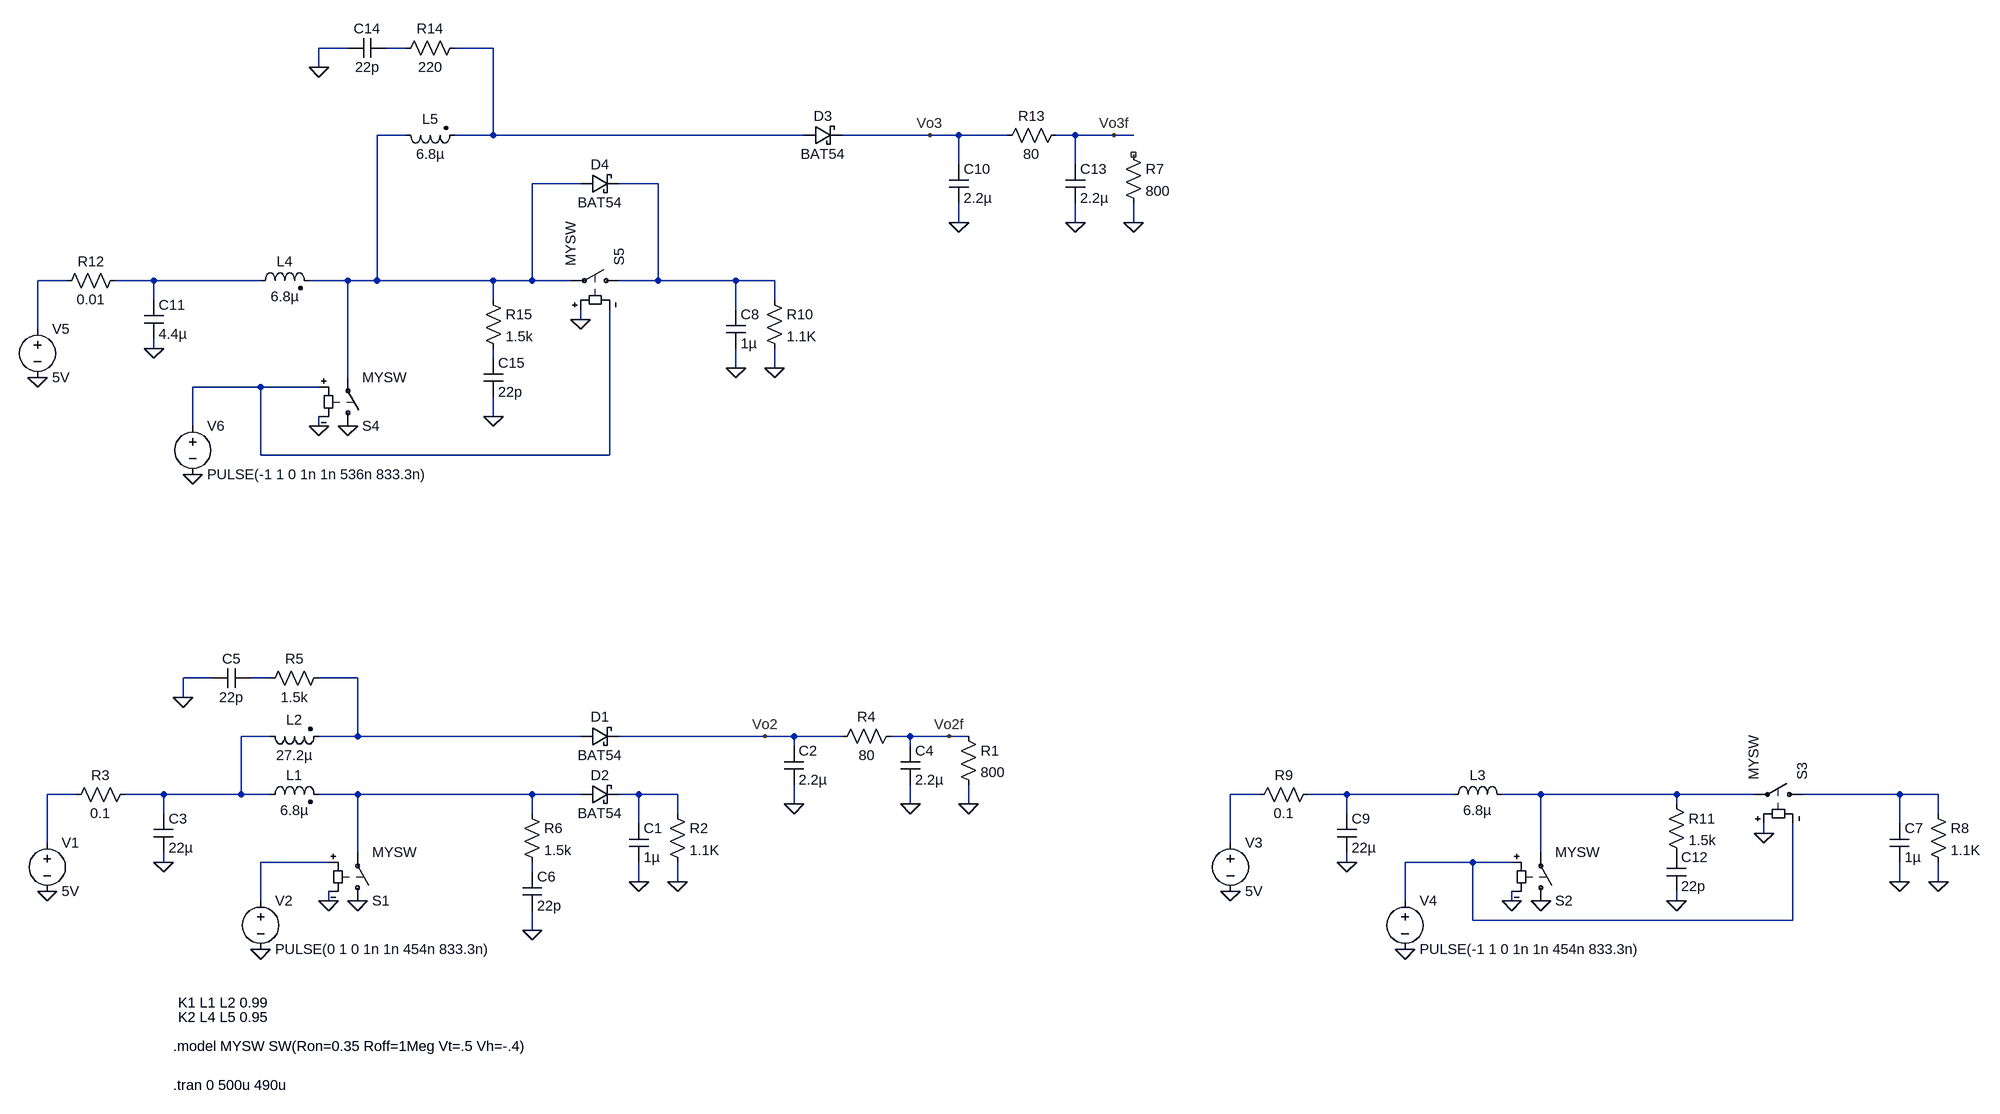
[diagram p0: schematic boost.asc]
boost.asc, the LTspice schematic file:
Version 4
SHEET 1 3604 680
WIRE 272 -1200 224 -1200
WIRE 368 -1200 336 -1200
WIRE 512 -1200 448 -1200
WIRE 224 -1168 224 -1200
WIRE 368 -1056 320 -1056
WIRE 512 -1056 512 -1200
WIRE 512 -1056 448 -1056
WIRE 1024 -1056 512 -1056
WIRE 1232 -1056 1088 -1056
WIRE 1280 -1056 1232 -1056
WIRE 1360 -1056 1280 -1056
WIRE 1472 -1056 1440 -1056
WIRE 1536 -1056 1472 -1056
WIRE 1568 -1056 1536 -1056
WIRE 1280 -1008 1280 -1056
WIRE 1472 -1008 1472 -1056
WIRE 656 -976 576 -976
WIRE 784 -976 720 -976
WIRE 1280 -912 1280 -944
WIRE 1472 -912 1472 -944
WIRE 1568 -912 1568 -944
WIRE -192 -816 -240 -816
WIRE -48 -816 -112 -816
WIRE 128 -816 -48 -816
WIRE 272 -816 208 -816
WIRE 320 -816 320 -1056
WIRE 320 -816 272 -816
WIRE 512 -816 320 -816
WIRE 576 -816 576 -976
WIRE 576 -816 512 -816
WIRE 640 -816 576 -816
WIRE 784 -816 784 -976
WIRE 784 -816 720 -816
WIRE 912 -816 784 -816
WIRE 976 -816 912 -816
WIRE -48 -784 -48 -816
WIRE 512 -784 512 -816
WIRE 976 -784 976 -816
WIRE 912 -768 912 -816
WIRE 656 -752 656 -768
WIRE -240 -736 -240 -816
WIRE -48 -704 -48 -720
WIRE 512 -688 512 -704
WIRE 912 -672 912 -704
WIRE 976 -672 976 -704
WIRE 272 -656 272 -816
WIRE 128 -640 16 -640
WIRE 224 -640 128 -640
WIRE 512 -592 512 -624
WIRE 16 -576 16 -640
WIRE 224 -576 224 -592
WIRE 128 -528 128 -640
WIRE 704 -528 704 -768
WIRE 704 -528 128 -528
WIRE 48 -160 0 -160
WIRE 144 -160 112 -160
WIRE 288 -160 224 -160
WIRE 0 -128 0 -160
WIRE 144 -64 96 -64
WIRE 288 -64 288 -160
WIRE 288 -64 224 -64
WIRE 656 -64 288 -64
WIRE 960 -64 720 -64
WIRE 1008 -64 960 -64
WIRE 1088 -64 1008 -64
WIRE 1200 -64 1168 -64
WIRE 1264 -64 1200 -64
WIRE 1296 -64 1264 -64
WIRE 1008 -48 1008 -64
WIRE 1200 -48 1200 -64
WIRE -176 32 -224 32
WIRE -32 32 -96 32
WIRE 96 32 96 -64
WIRE 96 32 -32 32
WIRE 144 32 96 32
WIRE 288 32 224 32
WIRE 576 32 288 32
WIRE 656 32 576 32
WIRE 752 32 720 32
WIRE 816 32 752 32
WIRE 1776 32 1728 32
WIRE 1920 32 1856 32
WIRE 2096 32 1920 32
WIRE 2240 32 2176 32
WIRE 2464 32 2240 32
WIRE 2592 32 2464 32
WIRE 2832 32 2672 32
WIRE 2896 32 2832 32
WIRE 1008 48 1008 16
WIRE 1200 48 1200 16
WIRE 1296 48 1296 16
WIRE 2464 48 2464 32
WIRE -32 64 -32 32
WIRE 576 64 576 32
WIRE 816 64 816 32
WIRE 1920 64 1920 32
WIRE 2896 64 2896 32
WIRE 752 80 752 32
WIRE 2832 80 2832 32
WIRE 2608 96 2608 80
WIRE -224 112 -224 32
WIRE 1728 112 1728 32
WIRE 288 128 288 32
WIRE 2240 128 2240 32
WIRE -32 144 -32 128
WIRE 240 144 128 144
WIRE 1920 144 1920 128
WIRE 2128 144 2016 144
WIRE 2192 144 2128 144
WIRE 576 160 576 144
WIRE 752 176 752 144
WIRE 816 176 816 144
WIRE 2832 176 2832 144
WIRE 2896 176 2896 144
WIRE 128 208 128 144
WIRE 240 208 240 192
WIRE 2016 208 2016 144
WIRE 2192 208 2192 192
WIRE 2464 208 2464 192
WIRE 2128 240 2128 144
WIRE 2656 240 2656 80
WIRE 2656 240 2128 240
WIRE 576 256 576 224
FLAG -224 192 0
FLAG 752 176 0
FLAG 1008 48 0
FLAG 816 176 0
FLAG 1296 48 0
FLAG 288 208 0
FLAG 240 208 0
FLAG 128 288 0
FLAG -32 144 0
FLAG 1200 48 0
FLAG 960 -64 Vo2
FLAG 1264 -64 Vo2f
FLAG 0 -128 0
FLAG 576 256 0
FLAG 1728 192 0
FLAG 2832 176 0
FLAG 2896 176 0
FLAG 2240 208 0
FLAG 2192 208 0
FLAG 2016 288 0
FLAG 1920 144 0
FLAG 2608 96 0
FLAG 2464 208 0
FLAG -240 -656 0
FLAG 912 -672 0
FLAG 1280 -912 0
FLAG 976 -672 0
FLAG 1568 -912 0
FLAG 272 -576 0
FLAG 224 -576 0
FLAG 16 -496 0
FLAG -48 -704 0
FLAG 1472 -912 0
FLAG 1232 -1056 Vo3
FLAG 1536 -1056 Vo3f
FLAG 224 -1168 0
FLAG 512 -592 0
FLAG 656 -752 0
SYMBOL voltage -224 96 R0
WINDOW 123 0 0 Left 0
WINDOW 39 0 0 Left 0
SYMATTR InstName V1
SYMATTR Value 5V
SYMBOL ind2 128 48 R270
WINDOW 0 32 56 VTop 2
WINDOW 3 5 56 VBottom 2
SYMATTR InstName L1
SYMATTR Value 6.8µ
SYMATTR Type ind
SYMBOL ind2 128 -80 M90
WINDOW 0 5 56 VBottom 2
WINDOW 3 32 56 VTop 2
SYMATTR InstName L2
SYMATTR Value 27.2µ
SYMATTR Type ind
SYMBOL schottky 656 -48 R270
WINDOW 0 32 32 VTop 2
WINDOW 3 0 32 VBottom 2
SYMATTR InstName D1
SYMATTR Value BAT54
SYMATTR Description Diode
SYMATTR Type diode
SYMBOL schottky 656 48 R270
WINDOW 0 32 32 VTop 2
WINDOW 3 0 32 VBottom 2
SYMATTR InstName D2
SYMATTR Value BAT54
SYMATTR Description Diode
SYMATTR Type diode
SYMBOL cap 736 80 R0
SYMATTR InstName C1
SYMATTR Value 1µ
SYMBOL cap 992 -48 R0
SYMATTR InstName C2
SYMATTR Value 2.2µ
SYMBOL res 1280 -80 R0
SYMATTR InstName R1
SYMATTR Value 800
SYMBOL res 800 48 R0
SYMATTR InstName R2
SYMATTR Value 1.1K
SYMBOL sw 288 224 M180
SYMATTR InstName S1
SYMATTR Value MYSW
SYMBOL voltage 128 192 R0
WINDOW 123 0 0 Left 0
WINDOW 39 0 0 Left 0
SYMATTR InstName V2
SYMATTR Value PULSE(0 1 0 1n 1n 454n 833.3n)
SYMBOL res -192 48 R270
WINDOW 0 32 56 VTop 2
WINDOW 3 0 56 VBottom 2
SYMATTR InstName R3
SYMATTR Value 0.1
SYMBOL cap -48 64 R0
SYMATTR InstName C3
SYMATTR Value 22µ
SYMBOL res 1184 -80 R90
WINDOW 0 0 56 VBottom 2
WINDOW 3 32 56 VTop 2
SYMATTR InstName R4
SYMATTR Value 80
SYMBOL cap 1184 -48 R0
SYMATTR InstName C4
SYMATTR Value 2.2µ
SYMBOL res 240 -176 R90
WINDOW 0 0 56 VBottom 2
WINDOW 3 32 56 VTop 2
SYMATTR InstName R5
SYMATTR Value 1.5k
SYMBOL cap 112 -176 R90
WINDOW 0 0 32 VBottom 2
WINDOW 3 32 32 VTop 2
SYMATTR InstName C5
SYMATTR Value 22p
SYMBOL res 560 48 R0
SYMATTR InstName R6
SYMATTR Value 1.5k
SYMBOL cap 560 160 R0
SYMATTR InstName C6
SYMATTR Value 22p
SYMBOL voltage 1728 96 R0
WINDOW 123 0 0 Left 0
WINDOW 39 0 0 Left 0
SYMATTR InstName V3
SYMATTR Value 5V
SYMBOL cap 2816 80 R0
SYMATTR InstName C7
SYMATTR Value 1µ
SYMBOL res 2880 48 R0
SYMATTR InstName R8
SYMATTR Value 1.1K
SYMBOL sw 2240 224 M180
SYMATTR InstName S2
SYMATTR Value MYSW
SYMBOL voltage 2016 192 R0
WINDOW 123 0 0 Left 0
WINDOW 39 0 0 Left 0
SYMATTR InstName V4
SYMATTR Value PULSE(-1 1 0 1n 1n 454n 833.3n)
SYMBOL res 1760 48 R270
WINDOW 0 32 56 VTop 2
WINDOW 3 0 56 VBottom 2
SYMATTR InstName R9
SYMATTR Value 0.1
SYMBOL cap 1904 64 R0
SYMATTR InstName C9
SYMATTR Value 22µ
SYMBOL ind 2080 48 R270
WINDOW 0 32 56 VTop 2
WINDOW 3 5 56 VBottom 2
SYMATTR InstName L3
SYMATTR Value 6.8µ
SYMBOL sw 2688 32 M270
SYMATTR InstName S3
SYMATTR Value MYSW
SYMBOL res 2448 32 R0
SYMATTR InstName R11
SYMATTR Value 1.5k
SYMBOL cap 2448 128 R0
SYMATTR InstName C12
SYMATTR Value 22p
SYMBOL voltage -240 -752 R0
WINDOW 123 0 0 Left 0
WINDOW 39 0 0 Left 0
SYMATTR InstName V5
SYMATTR Value 5V
SYMBOL ind2 112 -800 R270
WINDOW 0 32 56 VTop 2
WINDOW 3 5 56 VBottom 2
SYMATTR InstName L4
SYMATTR Value 6.8µ
SYMATTR Type ind
SYMBOL ind2 352 -1072 M90
WINDOW 0 5 56 VBottom 2
WINDOW 3 32 56 VTop 2
SYMATTR InstName L5
SYMATTR Value 6.8µ
SYMATTR Type ind
SYMBOL schottky 1024 -1040 R270
WINDOW 0 32 32 VTop 2
WINDOW 3 0 32 VBottom 2
SYMATTR InstName D3
SYMATTR Value BAT54
SYMATTR Description Diode
SYMATTR Type diode
SYMBOL cap 896 -768 R0
SYMATTR InstName C8
SYMATTR Value 1µ
SYMBOL cap 1264 -1008 R0
SYMATTR InstName C10
SYMATTR Value 2.2µ
SYMBOL res 1552 -1040 R0
SYMATTR InstName R7
SYMATTR Value 800
SYMBOL res 960 -800 R0
SYMATTR InstName R10
SYMATTR Value 1.1K
SYMBOL sw 272 -560 M180
SYMATTR InstName S4
SYMATTR Value MYSW
SYMBOL voltage 16 -592 R0
WINDOW 123 0 0 Left 0
WINDOW 39 0 0 Left 0
SYMATTR InstName V6
SYMATTR Value PULSE(-1 1 0 1n 1n 536n 833.3n)
SYMBOL res -208 -800 R270
WINDOW 0 32 56 VTop 2
WINDOW 3 0 56 VBottom 2
SYMATTR InstName R12
SYMATTR Value 0.01
SYMBOL cap -64 -784 R0
SYMATTR InstName C11
SYMATTR Value 4.4µ
SYMBOL res 1456 -1072 R90
WINDOW 0 0 56 VBottom 2
WINDOW 3 32 56 VTop 2
SYMATTR InstName R13
SYMATTR Value 80
SYMBOL cap 1456 -1008 R0
SYMATTR InstName C13
SYMATTR Value 2.2µ
SYMBOL res 464 -1216 R90
WINDOW 0 0 56 VBottom 2
WINDOW 3 32 56 VTop 2
SYMATTR InstName R14
SYMATTR Value 220
SYMBOL cap 336 -1216 R90
WINDOW 0 0 32 VBottom 2
WINDOW 3 32 32 VTop 2
SYMATTR InstName C14
SYMATTR Value 22p
SYMBOL res 496 -800 R0
SYMATTR InstName R15
SYMATTR Value 1.5k
SYMBOL cap 496 -688 R0
SYMATTR InstName C15
SYMATTR Value 22p
SYMBOL sw 736 -816 M270
SYMATTR InstName S5
SYMATTR Value MYSW
SYMBOL schottky 656 -960 R270
WINDOW 0 32 32 VTop 2
WINDOW 3 0 32 VBottom 2
SYMATTR InstName D4
SYMATTR Value BAT54
SYMATTR Description Diode
SYMATTR Type diode
TEXT -16 448 Left 2 !.model MYSW SW(Ron=0.35 Roff=1Meg Vt=.5 Vh=-.4)
TEXT -16 512 Left 2 !.tran 0 500u 490u
TEXT -8 376 Left 2 !K1 L1 L2 0.99
TEXT -8 400 Left 2 !K2 L4 L5 0.95

The netlist it stands for:
* boost.asc
V1 N012 0 5V
L1 N011 N013 6.8µ
L2 N011 N010 27.2µ
D1 N010 Vo2 BAT54
D2 N013 N014 BAT54
C1 N014 0 1µ
C2 Vo2 0 2.2µ
R1 Vo2f 0 800
R2 N014 0 1.1K
S1 0 N013 N019 0 MYSW
V2 N019 0 PULSE(0 1 0 1n 1n 454n 833.3n)
R3 N012 N011 0.1
C3 N011 0 22µ
R4 Vo2f Vo2 80
C4 Vo2f 0 2.2µ
R5 N010 N009 1.5k
C5 N009 0 22p
R6 N013 N021 1.5k
C6 N021 0 22p
V3 N015 0 5V
C7 N018 0 1µ
R8 N018 0 1.1K
S2 0 N017 N020 0 MYSW
V4 N020 0 PULSE(-1 1 0 1n 1n 454n 833.3n)
R9 N015 N016 0.1
C9 N016 0 22µ
L3 N016 N017 6.8µ
S3 N018 N017 0 N020 MYSW
R11 N017 P001 1.5k
C12 P001 0 22p
V5 N005 0 5V
L4 N006 N003 6.8µ
L5 N003 N002 6.8µ
D3 N002 Vo3 BAT54
C8 N004 0 1µ
C10 Vo3 0 2.2µ
R7 NC_01 0 800
R10 N004 0 1.1K
S4 0 N003 N008 0 MYSW
V6 N008 0 PULSE(-1 1 0 1n 1n 536n 833.3n)
R12 N005 N006 0.01
C11 N006 0 4.4µ
R13 Vo3f Vo3 80
C13 Vo3f 0 2.2µ
R14 N002 N001 220
C14 N001 0 22p
R15 N003 N007 1.5k
C15 N007 0 22p
S5 N004 N003 0 N008 MYSW
D4 N003 N004 BAT54
.model D D
.lib standard.dio
.model MYSW SW(Ron=0.35 Roff=1Meg Vt=.5 Vh=-.4)
.tran 0 500u 490u
K1 L1 L2 0.99
K2 L4 L5 0.95
.backanno
.end